# EAGLE design Intervalometer (EAGLE 7.0.0)
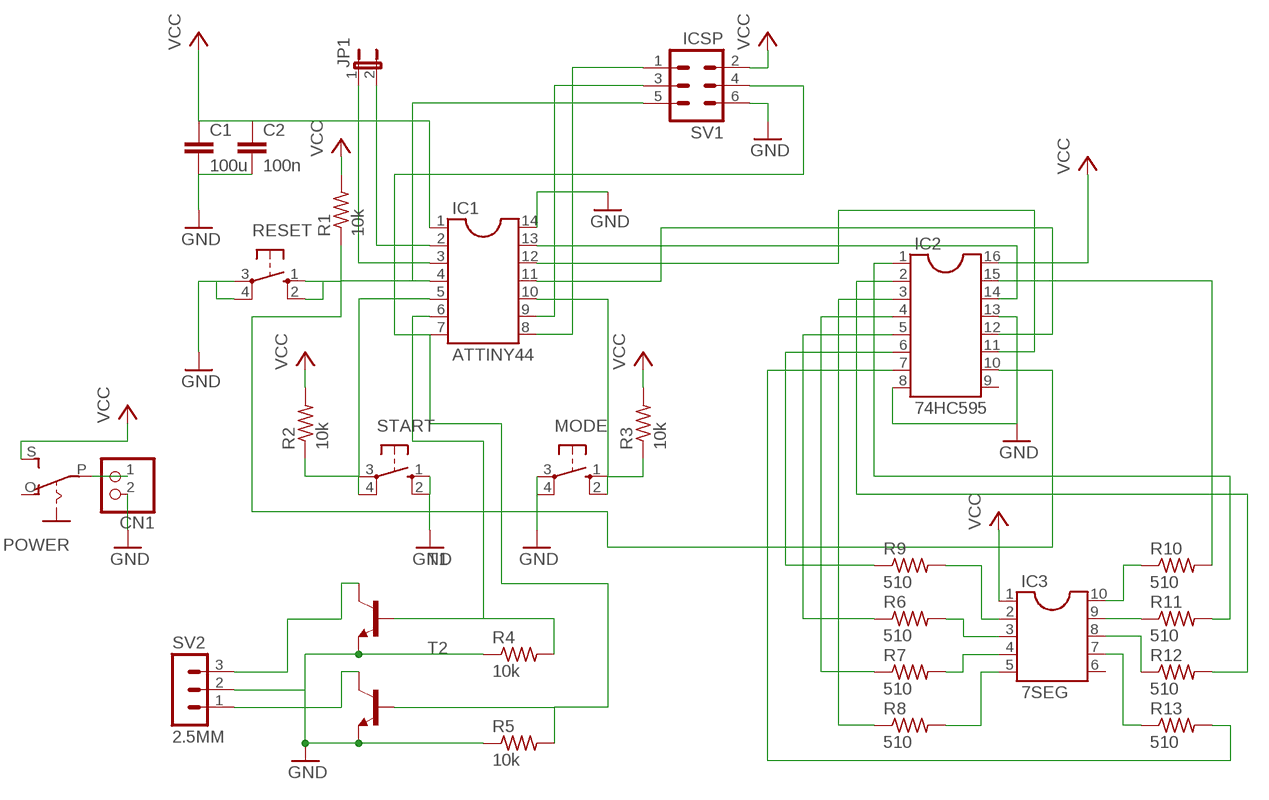
[diagram p0: schematic, sheet 1]

## Parts
C1  100u  C2,5-3  [C2.5-3]
C2  100n  C2,5-3  [C2.5-3]
CN1  JST_2PIN-SMT-RA  [JST-PH-2-SMT-RA]
IC1  ATTINY44  DIL14S  [SOCKET-14]
IC2  74HC595  DIL16S  [SOCKET-16]
IC3  7SEG  DIL10  [DIL10]
JP1  JP1E  [JP1]
MODE  10-XX  [B3F-10XX]
POWER  EG1218S  [EG1218]
R1  10k  R-US_0207/10  [0207/10]
R2  10k  R-US_0207/10  [0207/10]
R3  10k  R-US_0207/10  [0207/10]
R4  10k  R-US_0207/10  [0207/10]
R5  10k  R-US_0207/10  [0207/10]
R6  510  R-US_0207/10  [0207/10]
R7  510  R-US_0207/10  [0207/10]
R8  510  R-US_0207/10  [0207/10]
R9  510  R-US_0207/10  [0207/10]
R10  510  R-US_0207/10  [0207/10]
R11  510  R-US_0207/10  [0207/10]
R12  510  R-US_0207/10  [0207/10]
R13  510  R-US_0207/10  [0207/10]
RESET  10-XX  [B3F-10XX]
START  10-XX  [B3F-10XX]
SV1  ICSP  MA03-2  [MA03-2]
SV2  2.5MM  MA03-1  [MA03-1]
T1  -NPN-TO92-EBC  [TO92-EBC]
T2  -NPN-TO92-EBC  [TO92-EBC]

## Nets
GND: C1.2 C2.2 CN1.2 IC1.14 IC2.8 IC2.13 MODE.3(P) MODE.4(P1) R4.1 R5.1 RESET.3(P) RESET.4(P1) START.1(S) START.2(S1) SV1.6 SV2.2 T1.E T2.E
N$1: IC1.11 IC2.12
N$2: IC1.4 IC2.10 R1.1 RESET.1(S) RESET.2(S1) SV1.5
N$3: IC1.5 R2.1 START.3(P) START.4(P1)
N$4: IC1.10 MODE.1(S) MODE.2(S1) R3.1
N$5: IC1.13 IC2.14
N$6: IC1.12 IC2.11
N$7: IC1.2 JP1.2
N$8: SV2.1 T2.C
N$9: SV2.3 T1.C
N$10: IC1.6 R4.2 T1.B
N$11: IC1.7 R5.2 SV1.4 T2.B
N$12: IC3.2 R9.2
N$13: IC3.3 R6.2
N$14: IC3.4 R7.2
N$15: IC3.5 R8.2
N$16: IC3.10 R10.1
N$17: IC3.9 R11.1
N$18: IC3.8 R12.1
N$19: IC3.7 R13.1
N$20: IC2.15 R10.2
N$21: IC2.1 R11.2
N$22: IC2.2 R12.2
N$23: IC2.3 R8.1
N$24: IC2.4 R7.1
N$25: IC2.5 R6.1
N$26: IC2.6 R9.1
N$27: IC2.7 R13.2
N$28: IC1.9 SV1.3
N$29: IC1.8 SV1.1
N$30: IC1.3 JP1.1
N$31: CN1.1 POWER.P
VCC: C1.1 C2.1 IC1.1 IC2.16 IC3.1 POWER.S R1.2 R2.2 R3.2 SV1.2
Unconnected: IC2.9 IC3.6 POWER.O

## Library data of the parts
C1 C2 = capacitor-wima:C: CAPACITOR naming: grid - package width
CN1 = adafruit:JST_2PIN: JST 2-Pin Connectors of various flavors SMT-RA (S2B-PH-SM4) 4UConnector #17311 SMT (B2B-PH-SM4) THM-RA (S2B-PH) THM (B2B-PH)
IC1 = ic-package:DIL14: Dual In Line / Socket
IC2 = ic-package:DIL16: Dual In Line / Socket
IC3 = ic-package:DIL10: Dual In Line / Socket
JP1 = jumper:JP1E: JUMPER
MODE RESET START = switch-omron:10-XX: OMRON SWITCH; MPN: B3F-1000; OC_FARNELL: 176432; OC_NEWARK: 36M3542
POWER = adafruit:EG1218: SLIDING SWITCH 0.1" spacing through hole, vertical SPDT slide switch http://www.ladyada.net/library/pcb/eaglelibrary.html
R1-R13 = resistor:R-US_: RESISTOR, American symbol
SV1 = con-lstb:MA03-2: PIN HEADER; OC_FARNELL: unknown; OC_NEWARK: unknown
SV2 = con-lstb:MA03-1: PIN HEADER; OC_FARNELL: unknown; OC_NEWARK: unknown
T1 T2 = transistor:*-NPN-: NPN Transistror BF959 corrected 2008.03.06

## Board
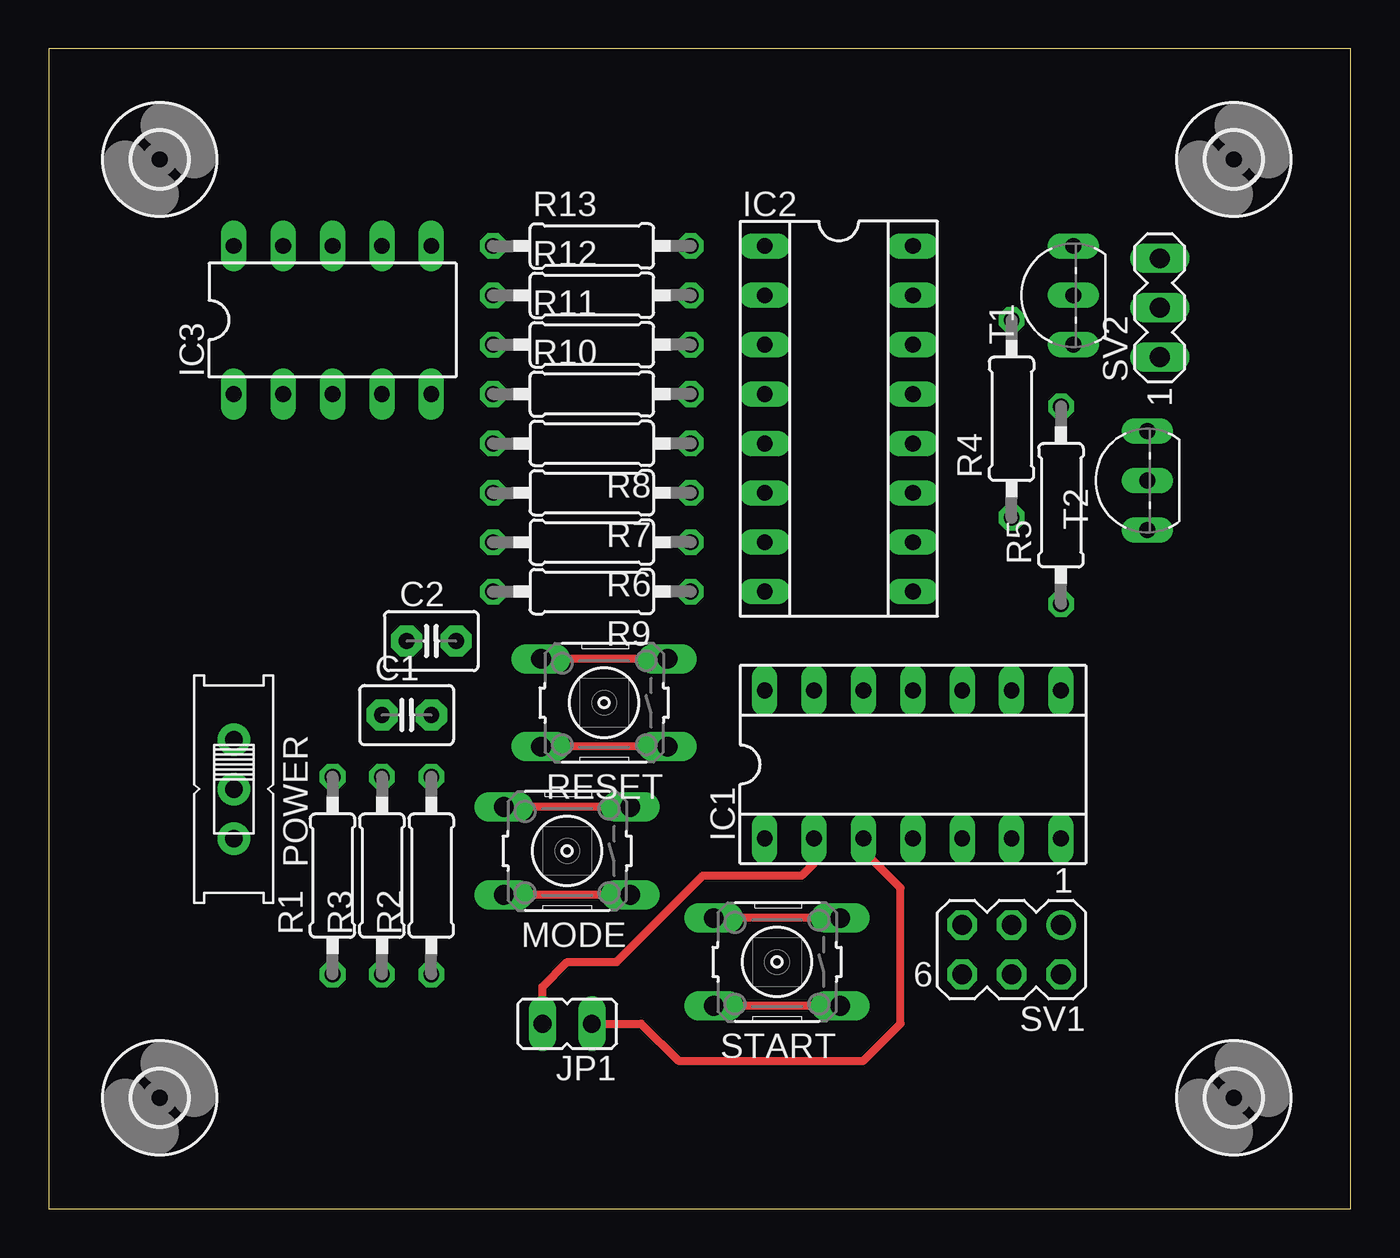
[diagram p1: board, top side]
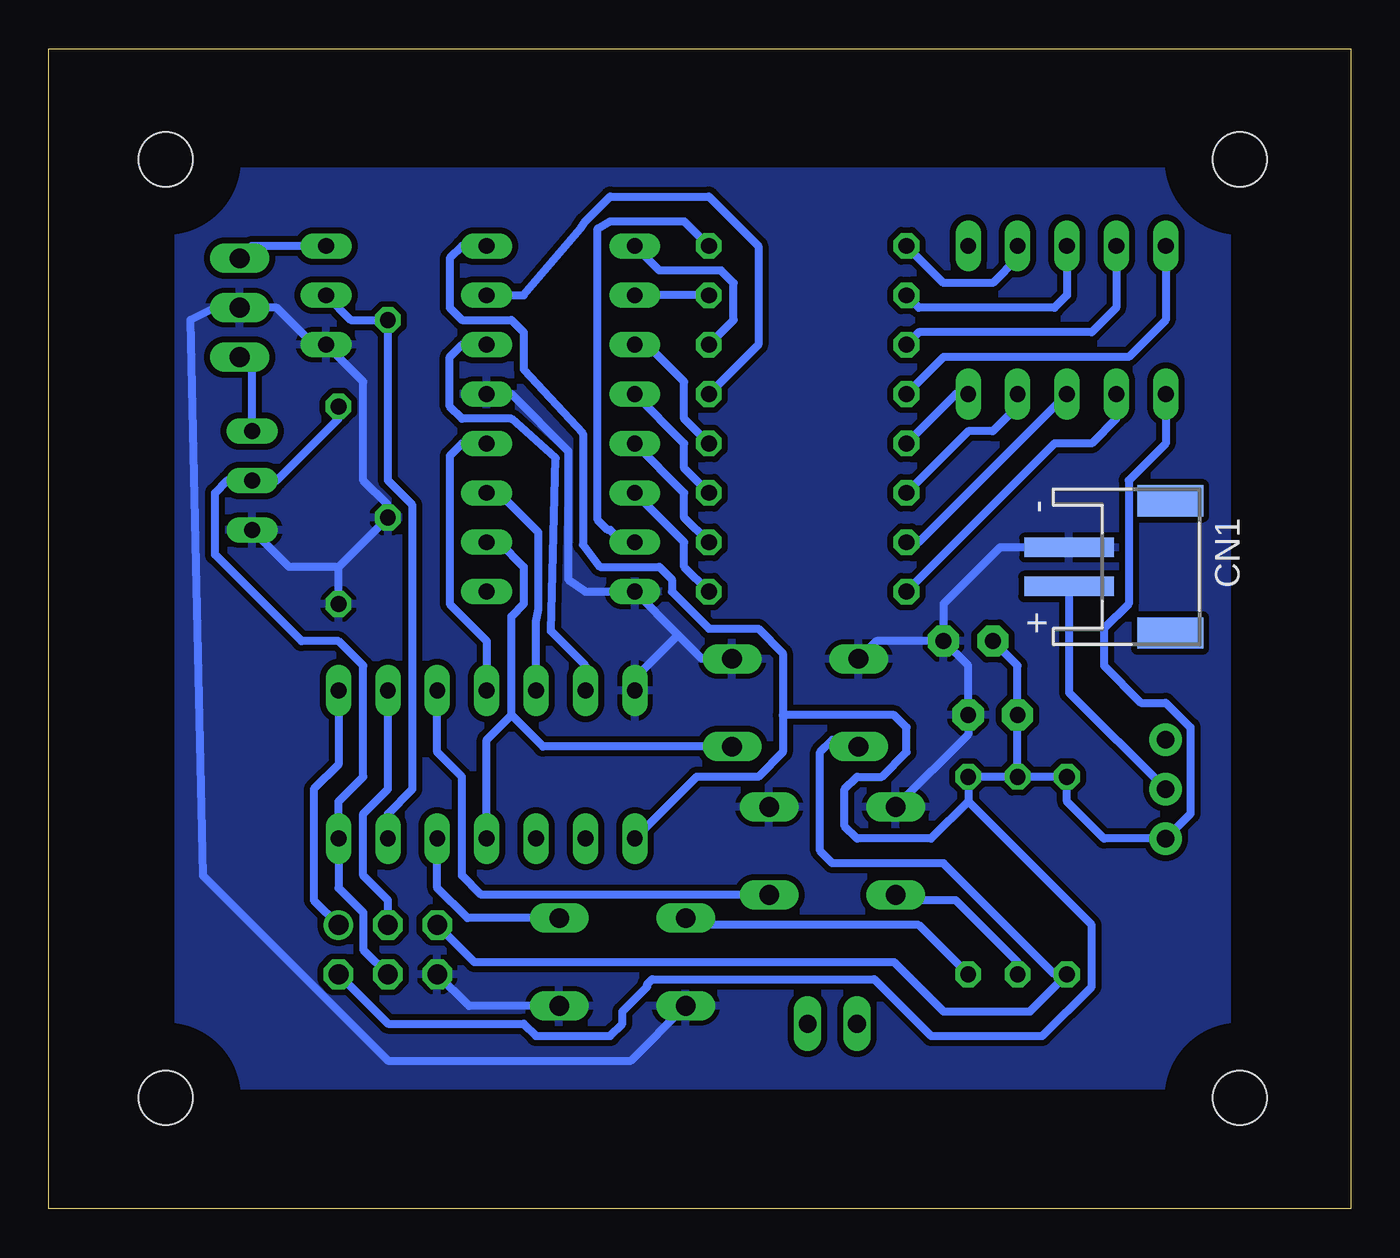
[diagram p2: board, bottom side, seen from below]

Size 66.98 x 59.68 mm. Coordinates in mm from the lower left corner, seen from the top.
Outline: 0,0 66.98,0 66.98,59.68 0,59.68 0,0
Copper layers (1*16): Top 0.035mm / dielectric 1.5mm / Bottom 0.035mm
Design rules "default": minimum track width 10mil, minimum drill 24mil, track to track 8mil, track to pad 8mil, pad to pad 8mil, via to via 8mil, smd to smd 8mil, copper to edge 40mil, drill to drill 8mil, minimum pad ring 10mil, minimum via ring 8mil, stop-mask expansion 4mil, vias tented up to drill 0mil, thermal gap 10mil

### Footprints (pad centres in the part's own frame; a part is rotated, then mirrored left to right if it is on the bottom)
C2.5-3 = drill 0.813 pad 1.6 octagon: 1 -1.27,0; 2 1.27,0
JST-PH-2-SMT-RA = smd 1 x 4.6: 1 1,-3.7; 2 -1,-3.7 | smd 1.6 x 3.4: NC1 -3.4,1.5; NC2 3.4,1.5
SOCKET-14 = drill 0.813 long: 1 -7.62,-3.81; 2 -5.08,-3.81; 3 -2.54,-3.81; 4 0,-3.81; 5 2.54,-3.81; 6 5.08,-3.81; 7 7.62,-3.81; 8 7.62,3.81; 9 5.08,3.81; 10 2.54,3.81; 11 0,3.81; 12 -2.54,3.81; 13 -5.08,3.81; 14 -7.62,3.81
SOCKET-16 = drill 0.813 long: 1 -8.89,-3.81; 2 -6.35,-3.81; 3 -3.81,-3.81; 4 -1.27,-3.81; 5 1.27,-3.81; 6 3.81,-3.81; 7 6.35,-3.81; 8 8.89,-3.81; 9 8.89,3.81; 10 6.35,3.81; 11 3.81,3.81; 12 1.27,3.81; 13 -1.27,3.81; 14 -3.81,3.81; 15 -6.35,3.81; 16 -8.89,3.81
DIL10 = drill 0.813 long: 1 -5.08,-3.81; 2 -2.54,-3.81; 3 0,-3.81; 4 2.54,-3.81; 5 5.08,-3.81; 6 5.08,3.81; 7 2.54,3.81; 8 0,3.81; 9 -2.54,3.81; 10 -5.08,3.81
JP1 = drill 0.914 long: 1 0,-1.27; 2 0,1.27
B3F-10XX = drill 1.016 long: 1 -3.251,2.261; 2 3.251,2.261; 3 -3.251,-2.261; 4 3.251,-2.261
EG1218 = drill 0.9 pad 1.676: O -2.54,0; P 0,0; S 2.54,0
0207/10 = drill 0.813 octagon: 1 -5.08,0; 2 5.08,0
MA03-2 = drill 1.016: 1 -2.54,-1.27 | drill 1.016 octagon: 2 -2.54,1.27; 3 0,-1.27; 4 0,1.27; 5 2.54,-1.27; 6 2.54,1.27
MA03-1 = drill 1.016 long: 1 -2.54,0; 2 0,0; 3 2.54,0
TO92-EBC = drill 0.813 long: B 0,-1.27; C 2.54,-1.27; E -2.54,-1.27
2,8 = hole 2.8: 0,0

### Placement (x,y rotation side)
C1  18.41,25.4 0 top
C2  19.69,29.21 0 top
CN1  10.8,33.02 270 bottom
IC1  44.45,22.86 0 top
IC2  40.64,40.64 270 top
IC3  14.61,45.72 0 top
JP1  26.67,9.52 90 top
MODE  26.67,18.41 180 top
POWER  9.53,21.59 270 top
R1  14.61,17.14 90 top
R2  19.69,17.14 90 top
R3  17.14,17.14 90 top
R4  49.53,40.64 90 top
R5  52.07,36.2 90 top
R6  27.94,34.29 180 top
R7  27.94,36.83 180 top
R8  27.94,39.37 180 top
R9  27.94,31.75 180 top
R10  27.94,41.91 0 top
R11  27.94,44.45 0 top
R12  27.94,46.99 0 top
R13  27.94,49.53 0 top
RESET  28.58,26.03 180 top
START  37.47,12.7 180 top
SV1  49.53,13.34 180 top
SV2  57.15,46.35 90 top
T1  51.44,46.99 90 top
T2  55.24,37.46 90 top
U$1  [2,8]  5.71,53.98 0 top
U$2  [2,8]  60.96,53.98 0 top
U$3  [2,8]  60.96,5.71 0 top
U$4  [2,8]  5.71,5.71 0 top

### Tracks (layer width: path | path; a pad name or v marks a point on that pad's centre or on a via)
GND
  Top 0.406: MODE.3 MODE.4 | RESET.3 RESET.4 | START.1 START.2
  Bottom 0.406: IC2.13 43.18,41.91 40.26,38.99 40.26,32.38 39.37,31.75 IC2.8 34.61,29.53 | RESET.3 33.38,28.3 34.61,29.53 | IC1.14 36.83,27.3 34.61,29.53 | C2.2 19.69,27.94 C1.2 19.69,24.41 MODE.4 | CN1.2 18.05,34.02 20.96,31.12 C2.2 | C2.2 24.41,29.21 RESET.4 | START.1 45.36,10.44 SV1.6 | R5.1 52.07,33.02 | 52.07,33.02 R4.1 49.53,36.2 50.8,37.46 50.8,42.54 T1.E 53.34,44.45 55.24,46.35 SV2.2 58.42,46.35 59.69,45.72 59.06,17.14 49.53,7.62 37.03,7.62 START.2 | 52.07,33.02 54.61,33.02 T2.E
  pour Bottom (isolate 0.305): 6.35,53.34 60.33,53.34 60.33,6.35 6.35,6.35
N$1
  Bottom 0.406: IC2.12 45.72,39.37 46.36,38.73 46.36,31.12 44.45,29.21 IC1.11
N$2
  Top 0.406: RESET.1 26.31,23.77 26.04,23.49 25.6,23.49 RESET.2
  Bottom 0.406: IC2.10 43.81,34.29 42.55,33.02 42.55,31.12 43.18,30.48 43.18,25.4 | IC1.4 44.45,24.13 43.18,25.4 | 43.18,25.4 41.55,23.77 RESET.1 | RESET.2 25.68,24.13 26.67,24.13 27.3,23.49 27.3,18.41 26.67,17.78 20.96,17.78 15.24,12.06 R1.1 16.51,10.16 20.96,10.16 23.5,12.7 45.09,12.7 SV1.5
N$3
  Top 0.406: START.3 START.4
  Bottom 0.406: R2.1 22.23,14.6 33.22,14.6 START.4 | START.3 45.44,14.96 46.99,16.51 IC1.5
N$4
  Top 0.406: MODE.1 MODE.2
  Bottom 0.406: R3.1 17.14,12.7 20.32,15.88 23.14,15.88 MODE.2 | MODE.1 44.73,16.15 45.72,17.14 45.72,22.23 46.99,23.49 IC1.10
N$5
  Bottom 0.406: IC1.13 39.37,27.94 41.15,29.72 40.89,38.61 43.18,40.64 45.72,40.64 46.36,41.27 46.36,43.82 45.72,44.45 IC2.14
N$6
  Bottom 0.406: IC1.12 41.91,30.23 41.78,30.86 41.78,34.8 43.81,36.83 IC2.11
N$7
  Top 0.406: JP1.2 25.4,11.43 26.67,12.7 29.21,12.7 33.66,17.14 38.73,17.14 39.37,17.78 IC1.2
N$8
  Bottom 0.406: T2.C 56.52,43.18 SV2.1
N$9
  Bottom 0.406: T1.C 56.52,49.53 SV2.3
N$10
  Bottom 0.406: T1.B 51.44,45.72 R4.2 49.53,37.46 48.26,36.2 48.26,21.59 49.53,20.32 IC1.6
N$11
  Bottom 0.406: R5.2 52.07,40.64 55.24,37.46 T2.B 57.78,37.46 58.42,36.83 58.42,33.66 53.98,29.21 52.07,29.21 50.8,27.94 50.8,22.23 52.07,20.95 IC1.7 52.07,16.51 50.8,15.24 50.8,13.34 SV1.4
N$12
  Bottom 0.406: IC3.2 12.07,40.64 13.34,39.37 15.24,39.37 R9.2
N$13
  Bottom 0.406: IC3.3 22.23,34.29 R6.2
N$14
  Bottom 0.406: IC3.4 17.14,41.27 18.41,40 19.69,40 R7.2
N$15
  Bottom 0.406: IC3.5 20.32,41.91 R8.2
N$16
  Bottom 0.406: IC3.10 9.53,45.72 11.43,43.82 20.96,43.82 R10.1
N$17
  Bottom 0.406: IC3.9 12.07,46.35 13.34,45.09 22.23,45.09 R11.1
N$18
  Bottom 0.406: IC3.8 14.61,46.99 15.24,46.35 22.23,46.35 R12.1
N$19
  Bottom 0.406: IC3.7 17.14,48.9 18.41,47.62 20.96,47.62 R13.1
N$20
  Bottom 0.406: IC2.15 42.55,46.99 39.62,50.42 39.37,50.8 38.1,52.07 33.02,52.07 30.48,49.53 30.48,44.45 R10.2
N$21
  Bottom 0.406: R11.2 31.75,45.72 31.75,47.62 32.38,48.26 35.56,48.26 IC2.1
N$22
  Bottom 0.406: R12.2 IC2.2
N$23
  Bottom 0.406: R8.1 34.29,40.64 34.29,42.54 36.2,44.45 IC2.3
N$24
  Bottom 0.406: R7.1 34.29,38.1 34.29,39.37 IC2.4
N$25
  Bottom 0.406: R6.1 34.29,35.56 34.29,36.83 IC2.5
N$26
  Bottom 0.406: R9.1 34.29,33.02 34.29,34.29 IC2.6
N$27
  Bottom 0.406: IC2.7 37.47,34.29 38.1,34.92 38.23,34.92 38.73,35.43 38.73,50.42 38.1,50.8 34.29,50.8 R13.2
N$28
  Bottom 0.406: SV1.3 49.53,15.88 50.8,17.14 50.8,20.32 49.53,21.59 IC1.9
N$29
  Bottom 0.406: IC1.8 52.07,22.86 53.34,21.59 53.34,15.88 SV1.1
N$30
  Top 0.406: JP1.1 30.48,9.52 32.38,7.62 41.91,7.62 43.81,9.52 43.81,16.51 41.91,18.41 IC1.3 41.91,19.68
N$31
  Bottom 0.406: CN1.1 14.5,26.56 POWER.P
VCC
  Bottom 0.406: R3.2 R1.2 14.61,20.95 12.7,19.05 POWER.S 8.25,20.32 8.25,24.77 9.53,26.03 10.8,26.03 12.7,27.94 12.7,29.84 11.43,31.12 11.43,37.46 9.53,39.37 IC3.1 | R3.2 R2.2 19.69,20.95 | R3.2 C1.1 17.14,27.94 C2.1 | IC2.16 45.72,49.53 46.36,48.9 46.36,46.35 45.72,45.72 43.18,45.72 42.55,45.09 42.55,43.18 39.5,39.88 39.5,34.16 38.61,33.02 35.56,33.02 34.92,32.38 34.92,31.75 33.02,29.84 30.48,29.84 29.21,28.57 29.21,25.4 | 29.21,25.4 29.21,23.49 30.48,22.23 33.66,22.23 IC1.1 | 19.69,20.95 21.59,19.05 25.4,19.05 26.04,19.68 26.04,21.59 25.4,22.23 24.13,22.23 22.86,23.49 22.86,24.77 23.5,25.4 29.21,25.4 | SV1.2 49.53,9.52 42.55,9.52 41.91,8.89 38.1,8.89 37.47,9.52 37.47,10.16 36.2,11.43 36.2,11.56 35.94,11.81 24.51,11.81 21.59,8.89 15.88,8.89 13.34,11.43 13.34,14.6 19.69,20.95